# Altium project PROC114E3_SCH.PrjPcb (part 18 of 22)

## Sheet 36.SchDoc
size 513 x 386 mm
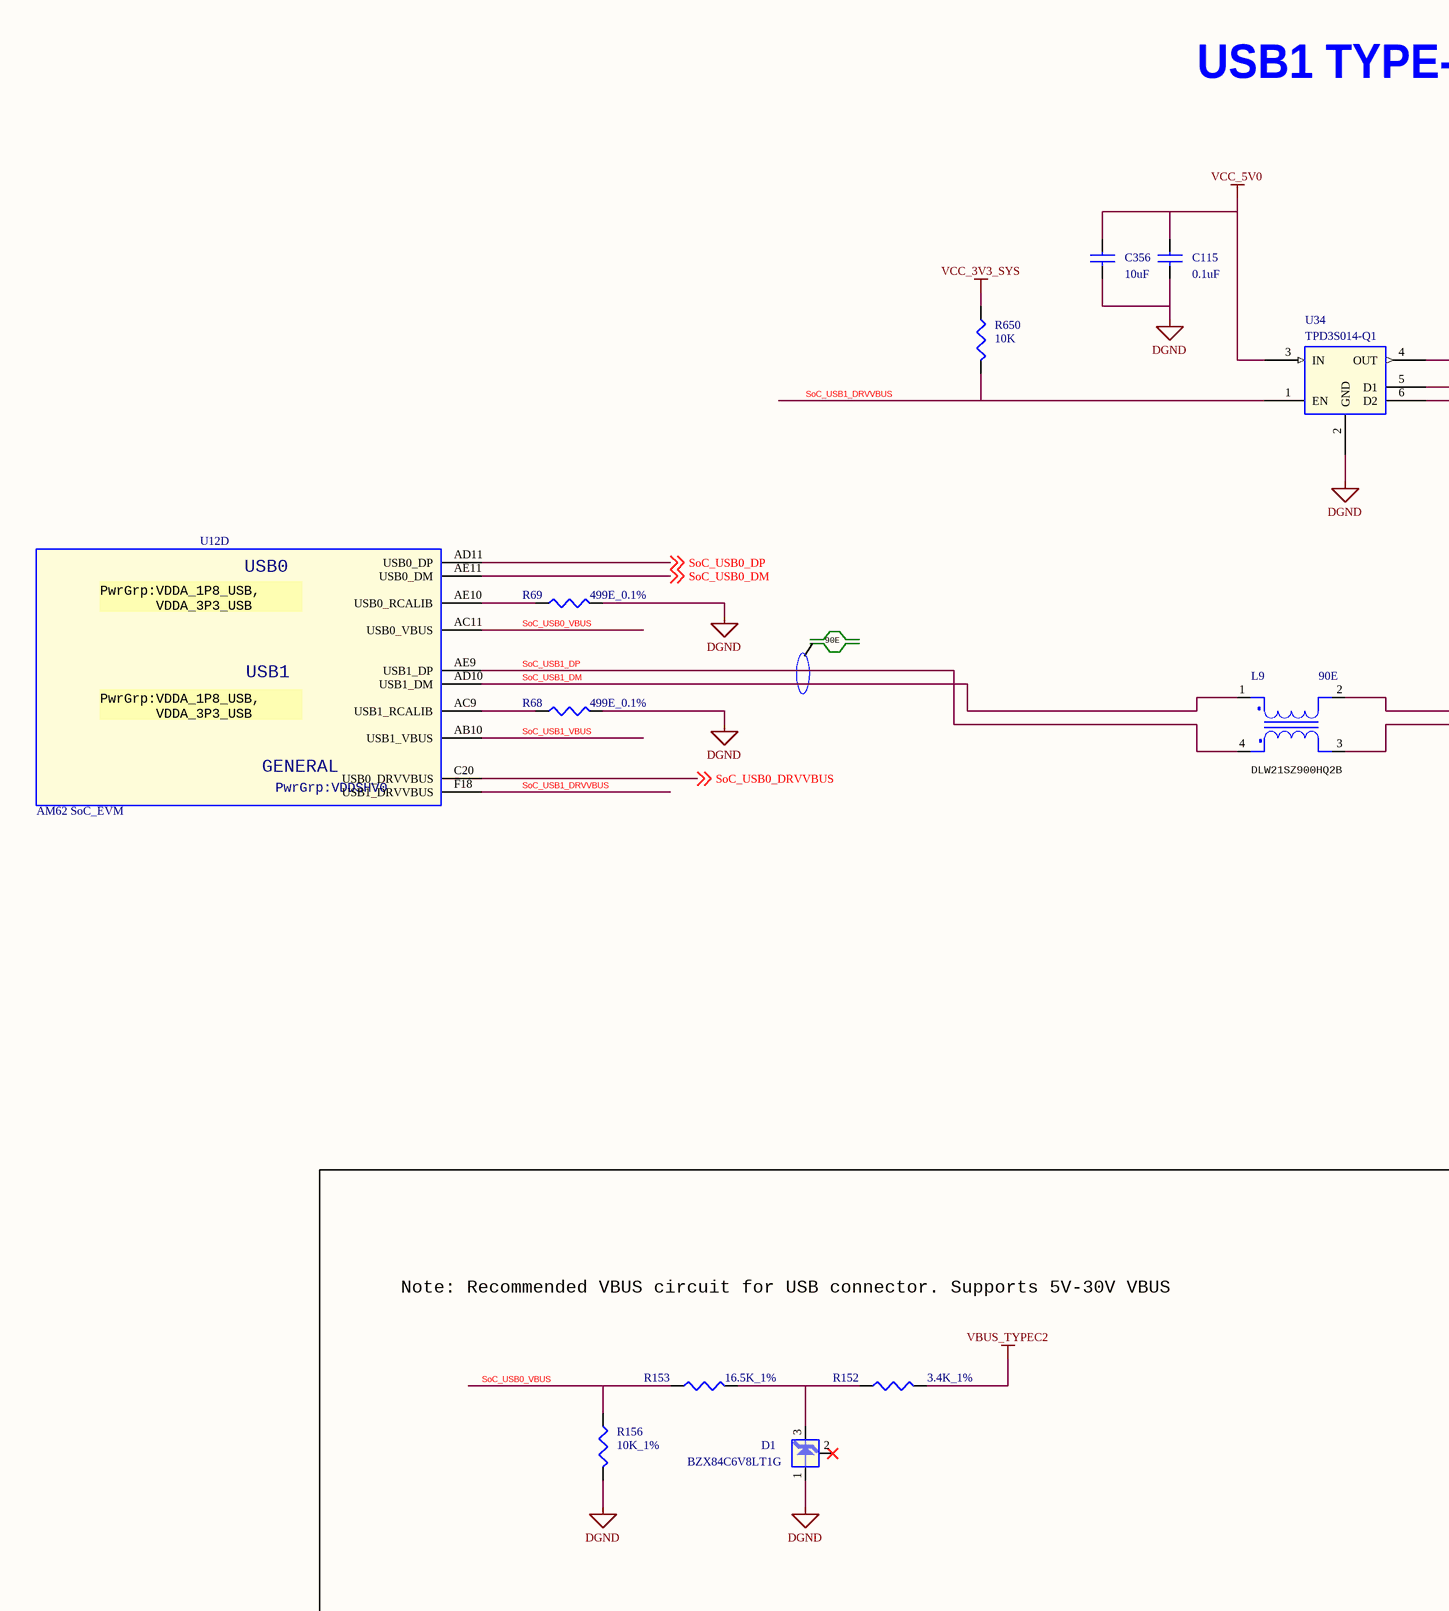
[diagram p64: 36.SchDoc, left]
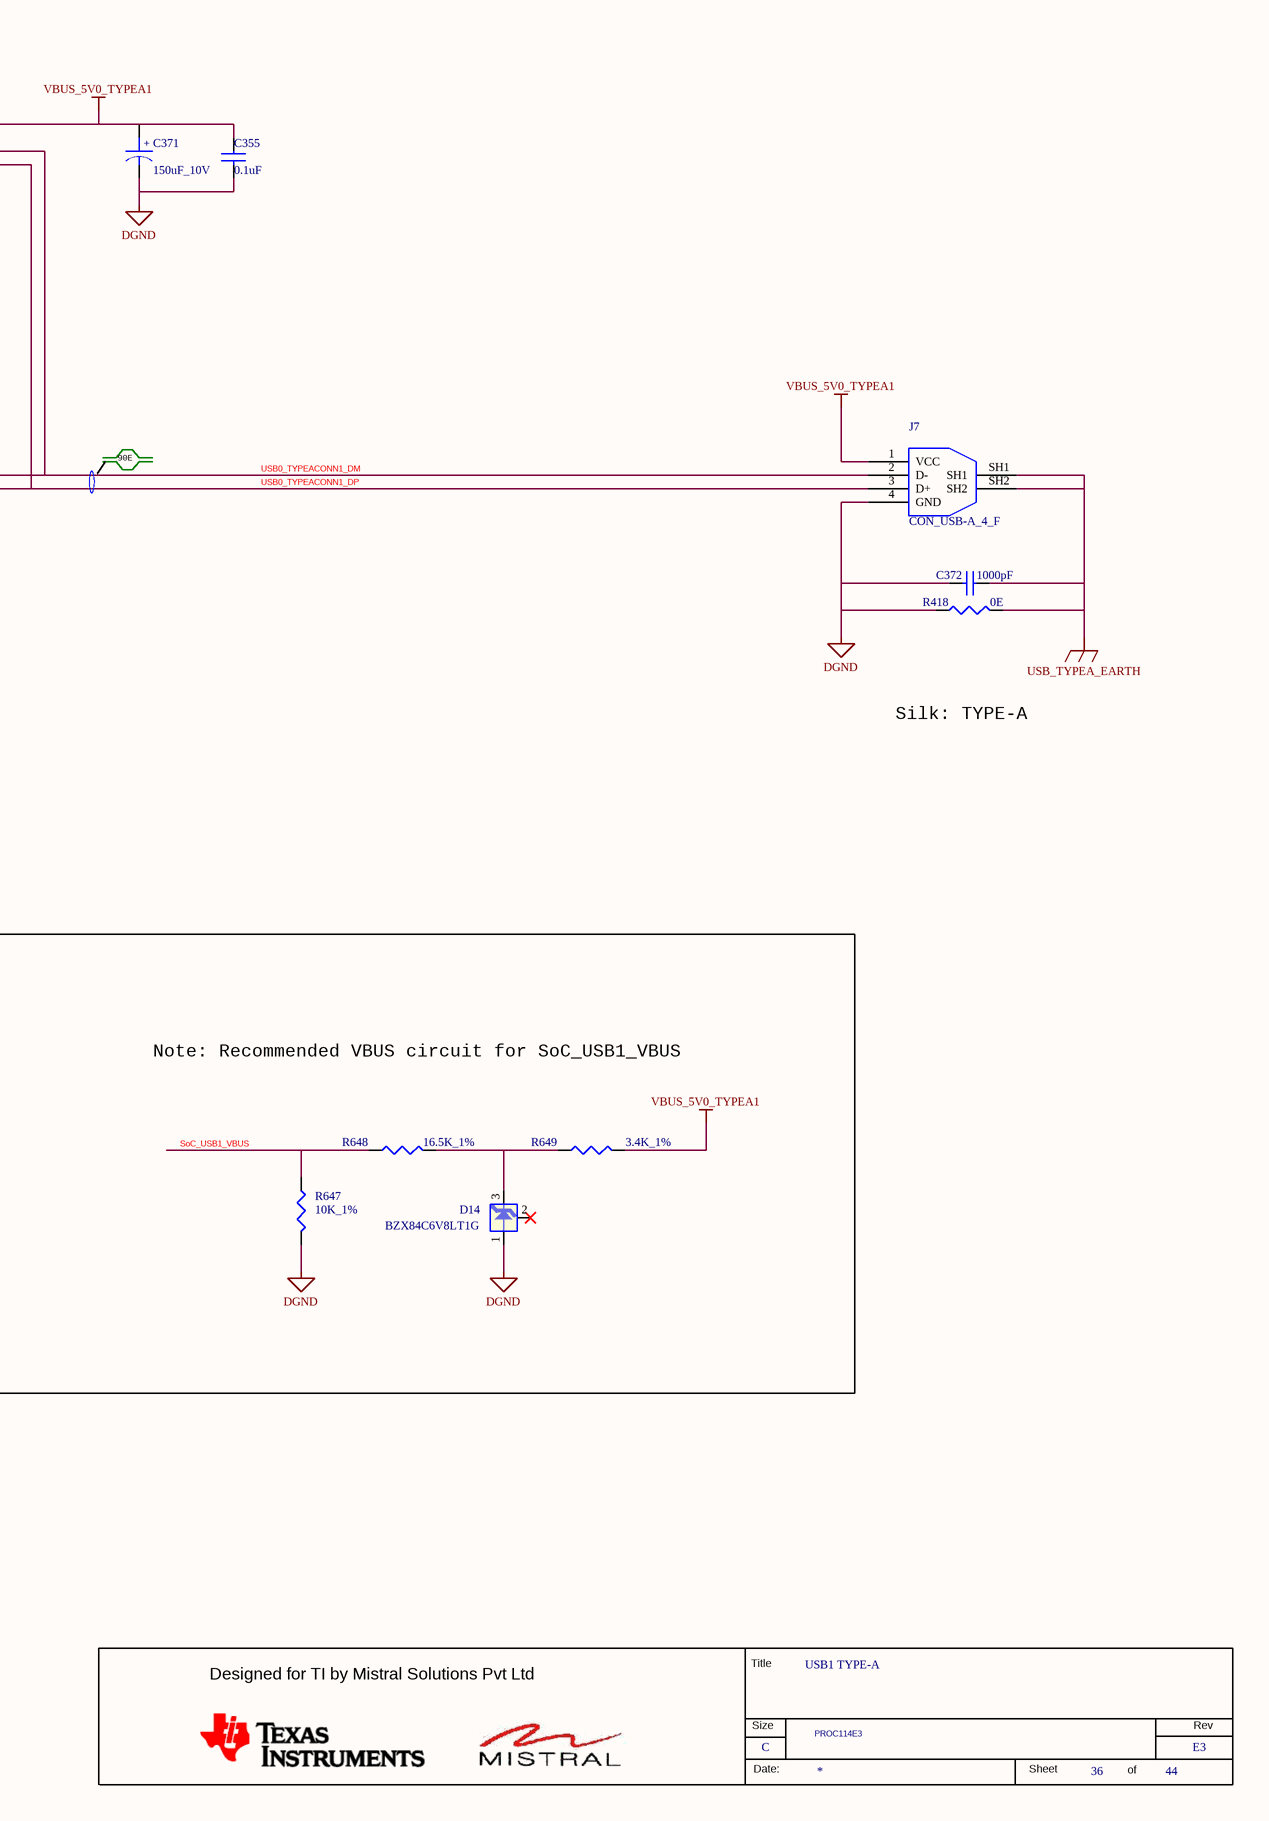
[diagram p65: 36.SchDoc, right]

### Parts
(Parts that share a designator on the sheet are numbered #1, #2 ... from top to bottom, then left to right.)
*#36  RevCode: E3  Title: USB1 TYPE-A  Page Size: C  Page Number: 36  Page Count: 44  Variant Name: PROC114E3  (hidden comment: MISTRAL_TITLEBLK_CSIZE)  (graphical)
C115  0.1uF  [CAP0201_0-5]
C355  0.1uF  [CAP0201_0-5]
C356  10uF  [CAP0603_1]
C371  150uF_10V  [CAPT7343D_3-25]
C372  1000pF  [CAP1206_1-75]
D1  BZX84C6V8LT1G  [SOT23-123_1-2]
D14  BZX84C6V8LT1G  [SOT23-123_1-2]
J7  CON_USB-A_4_F  [CON_USBA4_629104151_S_R_S_7-4]
L9  90E  [IND4_DLW21H_90X60_SMD_1-4]
R68  499E_0.1%  [RES0402_0-5]
R69  499E_0.1%  [RES0402_0-5]
R152  3.4K_1%  [RES0201_0-5]
R153  16.5K_1%  [RES0402_0-5]
R156  10K_1%  [RES0201_0-5]
R418  0E  [RES0603_0-75]
R647  10K_1%  [RES0201_0-5]
R648  16.5K_1%  [RES0402_0-5]
R649  3.4K_1%  [RES0201_0-5]
R650  10K  [RES0201_0-5]
U12#2  AM62 SoC_EVM  [BGA425_19-68_510X510_0-7]  (part D of 18)
U34  TPD3S014-Q1  [SOT23-6_1-5]

### Blocks framed on the sheet
Note: Recommended VBUS circuit for SoC_USB1_VBUS: D1 D14 R152 R153 R156 R647-R649

### Nets
DGND: C115.2 C355.2 C356.2 C371.2 C372.2 D1.1(A) D14.1(A) J7.4(GND) R68.2 R69.2 R156.2 R418.2 R647.2 U34.2(GND)
USB_TYPEA_EARTH: C372.1 J7.SH1 J7.SH2 R418.1
VBUS_5V0_TYPEA1: C355.1 C371.1 J7.1(VCC) R649.2 U34.4(OUT)
VBUS_TYPEC2: R152.2
VCC_3V3_SYS: R650.1
VCC_5V0: C115.1 C356.1 U34.3(IN)
SoC_USB0_DM: U12#2.AE11(USB0_DM) ; off-sheet SoC_USB0_DM
SoC_USB0_DP: U12#2.AD11(USB0_DP) ; off-sheet SoC_USB0_DP
SoC_USB0_DRVVBUS: U12#2.C20(USB0_DRVVBUS) ; off-sheet SoC_USB0_DRVVBUS
SoC_USB0_VBUS: R153.1 R156.1 U12#2.AC11(USB0_VBUS)
SoC_USB1_DM: L9.1(IN1) U12#2.AD10(USB1_DM)
SoC_USB1_DP: L9.4(OUT2) U12#2.AE9(USB1_DP)
SoC_USB1_DRVVBUS: R650.2 U12#2.F18(USB1_DRVVBUS) U34.1(EN)
SoC_USB1_VBUS: R647.1 R648.1 U12#2.AB10(USB1_VBUS)
USB0_TYPEACONN1_DM: J7.2(D-) L9.2(IN2) U34.5(D1)
USB0_TYPEACONN1_DP: J7.3(D+) L9.3(OUT1) U34.6(D2)
NetD1_3: D1.3(C) R152.1 R153.2
NetD14_3: D14.3(C) R648.2 R649.1
NetR68_1: R68.1 U12#2.AC9(USB1_RCALIB)
NetR69_1: R69.1 U12#2.AE10(USB0_RCALIB)

Not connected (* = marked no-connect by the designer): D1 2(NC)*; D14 2(NC)*

### Notes on the sheet
- USB1 TYPE-A
- 90E
- (near L9) DLW21SZ900HQ2B
- Silk: TYPE-A
- Note: Recommended VBUS circuit for USB connector. Supports 5V-30V VBUS
- (in symbol AM62-EVM_BGA425, part D) USB0; PwrGrp:VDDA_1P8_USB, / VDDA_3P3_USB; USB1; GENERAL; PwrGrp:VDDSHV0
- (in symbol CAP_POL) +
- (in symbol MISTRAL_TITLEBLK_CSIZE) Title; Designed for TI by Mistral Solutions Pvt Ltd; Size; Rev; Date:; Sheet; of

### Library data of the parts
*#36 = MISTRAL_TITLEBLK_CSIZE: Issue: 1.0; Page Create Date: March  8, 1995; Page Modify Date: *; Schematic Page Count: 44; Schematic Page Number: 36
C115 = CAP_Dup2: CAP CERAMIC 0.1uF 16V 10% X5R 0201; Part_type: CAPACITORS\CERAMIC; Mfr_part_number: GRM033R61C104KE14D; Mfr_name: MURATA; Mistral Part No: 120009030072-R; Custom_Duty: 15%; Customs_HS_Code: 85322990; Wattage: NA; Project: TI_MAXIE_CPB; Footprint Path: Y:\MIS_DATABASE\Library\ALTIUM_TOOL\PCB_FOOTPRINTS\Altium_Footprint_Lib.PcbLib; Library Path: Y:\MIS_DATABASE\Library\ALTIUM_TOOL\SCHEMATICS_PARTS\MS_DISCRETE_Library.schlib; MECHANICAL 3D STEP FILE: CAP0201_0-5; Chkd/date: MANIRAJA/230118; Crtd /date: MANIRAJA/230118; Datasheet: Y:\MIS_DATABASE\DATASHEETS\CAPACITORS\GRM033R61C104KE14.PDF; Temperature: -55°C+85°C; Weight: 0.33mg; Height: 0.33MM; Footprint Ref: CAP0201_0-5; Library Ref: CAP; Distributor_part_number: 490-14305-1-ND; Distributor_name: DIGIKEY; Package: 0201; Voltage: 16V; Tolerance: 10%; PCB Footprint: CAP0201_0-5
C355 = CAP_Dup2: CAP CERAMIC 0.1uF 16V 10% X5R 0201; Mistral Part No: 120009030072-R; Mfr_name: MURATA; Mfr_part_number: GRM033R61C104KE14D; Part_type: CAPACITORS\CERAMIC; Project: TI_MAXIE_CPB; Wattage: NA; Customs_HS_Code: 85322990; Custom_Duty: 15%; Tolerance: 10%; Voltage: 16V; Package: 0201; Distributor_name: DIGIKEY; Distributor_part_number: 490-14305-1-ND; Library Ref: CAP; Footprint Ref: CAP0201_0-5; Height: 0.33MM; Weight: 0.33mg; Temperature: -55°C+85°C; Datasheet: Y:\MIS_DATABASE\DATASHEETS\CAPACITORS\GRM033R61C104KE14.PDF; Crtd /date: MANIRAJA/230118; Chkd/date: MANIRAJA/230118; MECHANICAL 3D STEP FILE: CAP0201_0-5; Library Path: Y:\MIS_DATABASE\Library\ALTIUM_TOOL\SCHEMATICS_PARTS\MS_DISCRETE_Library.schlib; Footprint Path: Y:\MIS_DATABASE\Library\ALTIUM_TOOL\PCB_FOOTPRINTS\Altium_Footprint_Lib.PcbLib; PCB Footprint: CAP0201_0-5
C356 = CAP_Dup2: CAP CERAMIC 10uF 35V 20% X5R 0603; Part_type: CAPACITORS\CERAMIC; Mfr_part_number: GRM188R6YA106MA73D; Mfr_name: MURATA; Mistral Part No: 120019050016-R; Custom_Duty: 15%; Customs_HS_Code: 85322990; Wattage: NA; Project: BRUKER_SD820_COMMONDO; Footprint Path: Y:\MIS_DATABASE\Library\ALTIUM_TOOL\PCB_FOOTPRINTS\Altium_Footprint_Lib.PcbLib; Library Path: Y:\MIS_DATABASE\Library\ALTIUM_TOOL\SCHEMATICS_PARTS\MS_DISCRETE_Library.schlib; MECHANICAL 3D STEP FILE: CAP0603_1; Chkd/date: MANIRAJA/170519; Crtd /date: ALVY/160519; Datasheet: Y:\MIS_DATABASE\DATASHEETS\CAPACITORS\GRM188R6YA106MA73.PDF; Temperature: -55°C+85°C; Weight: 9mg; Height: 1.00MM; Footprint Ref: CAP0603_1; Library Ref: CAP; Distributor_part_number: 490-13248-1-ND; Distributor_name: DIGIKEY; Package: 0603; Voltage: 35V; Tolerance: 20%; PCB Footprint: CAP0603_1
C371 = CAP_POL: CAP TANTALUM 150uF 10V 10% ESR 600mE D7343; Part_type: CAPACITORS\TANTALUM; Mfr_part_number: 293D157X9010D2TE3; Mfr_name: VISHAY; Mistral Part No: 120021090007-R; Custom_Duty: 15%; Customs_HS_Code: 85322990; Wattage: NA; Project: TI_AM62x SKEVM_BRD; Footprint Path: Y:\MIS_DATABASE\Library\ALTIUM_TOOL\PCB_FOOTPRINTS\Altium_Footprint_Lib.PcbLib; Library Path: Y:\MIS_DATABASE\Library\ALTIUM_TOOL\SCHEMATICS_PARTS\MS_DISCRETE_Library.schlib; MECHANICAL 3D STEP FILE: CAPT7343D_3-25; Chkd/date: ALVY/200921; Crtd /date: MANIRAJA/200921; Datasheet: Y:\MIS_DATABASE\DATASHEETS\CAPACITORS\293D_SER_MAR20.PDF; Temperature: -55°C+125°C; Weight: 400mg; Height: 3.10MM; Footprint Ref: CAPT7343D_3-25; Library Ref: CAP_POL; Distributor_part_number: 718-1960-1-ND; Distributor_name: DIGIKEY; Package: D7343; Voltage: 10V; Tolerance: 10%; PCB Footprint: CAPT7343D_3-25
C372 = CAP_Dup2: CAP CERAMIC 1000pF 2KV 10% X7R 1206; Part_type: CAPACITORS\CERAMIC; Mfr_part_number: 1206GC102KAT1A; Mfr_name: AVX CORPORATION; Mistral Part No: 120015080006-R; Wattage: NA; Custom_Duty: 15%; Customs_HS_Code: 85322990; Project: ADR1B; MECHANICAL 3D STEP FILE: CAP1206_1-75; Footprint Path: Y:\MIS_DATABASE\Library\ALTIUM_TOOL\PCB_FOOTPRINTS\Altium_Footprint_Lib.PcbLib; Library Path: Y:\MIS_DATABASE\Library\ALTIUM_TOOL\SCHEMATICS_PARTS\MS_DISCRETE_Library.schlib; Footprint Ref: CAP1206_1-75; Library Ref: CAP; Chkd/date: SHREESHAIL/291106; Crtd /date: MAZHAR/281106; Datasheet: Y:\MIS_DATABASE\DATASHEETS\CAPACITORS\AVX_HV-MLC.PDF; Temperature: -55°C+125°C; Weight: 16.2mg; Height: 1.52MM; Distributor_part_number: 478-2956-1-ND; Distributor_name: DIGIKEY; Package: 1206; Voltage: 2KV; Tolerance: 10%; PCB Footprint: CAP1206_1-75
D1 = DIODE_ZENER_SOT23_13: DIODE ZENER 250mW 6.8V SOT23-123; Mistral Part No: 130017100002-R; Mfr_name: ON SEMICONDUCTOR; Part_type: DIODE\ZENER; Project: TI_MAXIE_CPB; Tolerance: NA; Customs_HS_Code: 85412900; Custom_Duty: 15%; Mfr_part_number: BZX84C6V8LT1G; Voltage: 6.8V; Wattage: NA; Package: SOT23-123; Distributor_name: DIGIKEY; Distributor_part_number: BZX84C6V8LT1GOSCT-ND; Library Ref: DIODE_ZENER_SOT23_13; Height: 1.11MM; Weight: 8mg; Temperature: -65°C+150°C; Datasheet: Y:\MIS_DATABASE\DATASHEETS\DISCRETES\DIODES\BZX84XX.PDF; Crtd /date: MANIRAJA/031017; Chkd/date: MANIRAJA/031017; MECHANICAL 3D STEP FILE: SOT23-123_1-2; PCB Footprint: SOT23-123_1-2
D14 = DIODE_ZENER_SOT23_13: DIODE ZENER 250mW 6.8V SOT23-123; Part_type: DIODE\ZENER; Mfr_name: ON SEMICONDUCTOR; Mistral Part No: 130017100002-R; Custom_Duty: 15%; Customs_HS_Code: 85412900; Wattage: NA; Project: TI_MAXIE_CPB; MECHANICAL 3D STEP FILE: SOT23-123_1-2; Chkd/date: MANIRAJA/031017; Crtd /date: MANIRAJA/031017; Datasheet: Y:\MIS_DATABASE\DATASHEETS\DISCRETES\DIODES\BZX84XX.PDF; Temperature: -65°C+150°C; Weight: 8mg; Height: 1.11MM; Library Ref: DIODE_ZENER_SOT23_13; Distributor_part_number: BZX84C6V8LT1GOSCT-ND; Distributor_name: DIGIKEY; Package: SOT23-123; Voltage: 6.8V; Tolerance: NA; Mfr_part_number: BZX84C6V8LT1G; PCB Footprint: SOT23-123_1-2
J7 = CON_USB-A_4_2SH: CON USB-A TYPE 4POS FEMALE RT SMD; Part_type: CONNECTOR\USB; Mfr_part_number: 629104151021; Mfr_name: WURTH ELECTRONICS; Mistral Part No: 150017100042-R; Custom_Duty: 24%; Customs_HS_Code: 85369090; Wattage: NA; Project: TI_SVB_MAXWELL_SPM; MECHANICAL 3D STEP FILE: CON_USBA4_629104151_S_R_S_7-4; Chkd/date: MANIRAJA/271017; Crtd /date: MANIRAJA/271017; Datasheet: Y:\MIS_DATABASE\DATASHEETS\CONNECTORS\629104151021.PDF; Temperature: -40°C+85°C; Weight: NA; Height: 7.35MM; Library Ref: CON_USB-A_4_2SH; Distributor_part_number: 732-5969-1-ND; Distributor_name: DIGIKEY; Package: SMD; Voltage: NA; Tolerance: NA; PCB Footprint: CON_USBA4_629104151_S_R_S_7-4
L9 = INDUCTOR_DLW31S: as L10 on sheet 35; PCB Footprint: IND4_DLW21H_90X60_SMD_1-4; Footprint Path: Y:\MIS_DATABASE\Library\ALTIUM_TOOL\PCB_FOOTPRINTS\Altium_Footprint_Lib.PcbLib; Library Path: Y:\MIS_DATABASE\Library\ALTIUM_TOOL\SCHEMATICS_PARTS\MS_DISCRETE_Library.schlib; MECHANICAL 3D STEP FILE: IND4_DLW21H_90X60_SMD_1-4; Chkd/date: MANIRAJA/270619; Crtd /date: MANIRAJA/270619; Datasheet: Y:\MIS_DATABASE\DATASHEETS\DISCRETES\INDUCTORS\DLW21SZ900HQ2B.PDF; Temperature: -40°C+105°C; Weight: 11mg; Height: 1.40MM; Footprint Ref: IND4_DLW21H_90X60_SMD_1-4; Library Ref: INDUCTOR_DLW31S; Distributor_part_number: NA; Distributor_name: NA; Package: SMD; Voltage: NA; Tolerance: NA; Part_type: INDUCTOR
R68 R69 = RESISTOR_Dup6: RES 499E 1/16W 0.1% 0402; Mistral Part No: 110021020006-R; Mfr_name: YAGEO AMERICA; Mfr_part_number: RT0402BRD07499RL; Part_type: RESISTORS\FIXED; Project: TI_AM62x SKEVM_BRD; Voltage: NA; Customs_HS_Code: 85332119; Custom_Duty: 15%; Tolerance: 0.1%; Wattage: 1/16W; Package: 0402; Distributor_name: DIGIKEY; Distributor_part_number: YAG1440CT-ND; Library Ref: RESISTOR; Footprint Ref: RES0402_0-5; Height: 0.35MM; Weight: 0.65mg; Temperature: -55°C+155°C; Datasheet: Y:\MIS_DATABASE\DATASHEETS\RESISTORS\YAGEO_RT-SERIES.PDF; Crtd /date: MANIRAJA/200921; Chkd/date: ALVY/200921; MECHANICAL 3D STEP FILE: RES0402_0-5; Library Path: Y:\MIS_DATABASE\Library\ALTIUM_TOOL\SCHEMATICS_PARTS\MS_DISCRETE_Library.schlib; Footprint Path: Y:\MIS_DATABASE\Library\ALTIUM_TOOL\PCB_FOOTPRINTS\Altium_Footprint_Lib.PcbLib; PCB Footprint: RES0402_0-5
R152 = RESISTOR_Dup6: RES 3.4K 1/20W 1% 0201; Part_type: RESISTORS\FIXED; Mfr_part_number: ERJ-1GNF3401C; Mfr_name: PANASONIC-ECG; Mistral Part No: 110016010003-R; Custom_Duty: 15%; Customs_HS_Code: 85332119; Voltage: NA; Project: QUADIO; Footprint Path: Y:\MIS_DATABASE\Library\ALTIUM_TOOL\PCB_FOOTPRINTS\Altium_Footprint_Lib.PcbLib; Library Path: Y:\MIS_DATABASE\Library\ALTIUM_TOOL\SCHEMATICS_PARTS\MS_DISCRETE_Library.schlib; MECHANICAL 3D STEP FILE: RES0201_0-5; Chkd/date: VASANTHA/250116; Crtd /date: VASANTHA/250116; Datasheet: Y:\MIS_DATABASE\DATASHEETS\RESISTORS\PAN-ERJSER_NOV17.PDF; Temperature: -55°C+125°C; Weight: 0.15mg; Height: 0.26MM; Library Ref: RESISTOR; Distributor_part_number: ERJ-1GNF3401C-ND; Distributor_name: DIGIKEY; Package: 0201; Wattage: 1/20W; Tolerance: 1%; Footprint Ref: RES0201_0-5; PCB Footprint: RES0201_0-5
R153 = RESISTOR_Dup6: RES 16.5K 1/16W 1% 0402; Part_type: RESISTORS\FIXED; Mfr_part_number: RC0402FR-0716K5L; Mfr_name: YAGEO AMERICA; Mistral Part No: 110020120011-R; Custom_Duty: 15%; Customs_HS_Code: 85332119; Voltage: NA; Project: TI_AM243x LP EVM; Footprint Path: Y:\MIS_DATABASE\Library\ALTIUM_TOOL\PCB_FOOTPRINTS\Altium_Footprint_Lib.PcbLib; Library Path: Y:\MIS_DATABASE\Library\ALTIUM_TOOL\SCHEMATICS_PARTS\MS_DISCRETE_Library.schlib; MECHANICAL 3D STEP FILE: RES0402_0-5; Chkd/date: ALVY/091220; Crtd /date: MANIRAJA/091220; Datasheet: Y:\MIS_DATABASE\DATASHEETS\RESISTORS\RCXXXXL-SER_MAR18.PDF; Temperature: -55°C+155°C; Weight: 0.65mg; Height: 0.40MM; Library Ref: RESISTOR; Distributor_part_number: YAG3002CT-ND; Distributor_name: DIGIKEY; Package: 0402; Wattage: 1/16W; Tolerance: 1%; Footprint Ref: RES0402_0-5; PCB Footprint: RES0402_0-5
R156 = RESISTOR_Dup6: RES 10K 1/20W 1% 0201; Part_type: RESISTORS\FIXED; Mfr_part_number: RC0201FR-0710KL; Mfr_name: YAGEO AMERICA; Mistral Part No: 110011040018-R; Custom_Duty: 15%; Customs_HS_Code: 85332119; Voltage: NA; Project: GOLDEN-I LITE; Footprint Path: Y:\MIS_DATABASE\Library\ALTIUM_TOOL\PCB_FOOTPRINTS\Altium_Footprint_Lib.PcbLib; Library Path: Y:\MIS_DATABASE\Library\ALTIUM_TOOL\SCHEMATICS_PARTS\MS_DISCRETE_Library.schlib; MECHANICAL 3D STEP FILE: RES0201_0-5; Chkd/date: VASANTHA/270117; Crtd /date: MANIRAJA/270117; Datasheet: Y:\MIS_DATABASE\DATASHEETS\RESISTORS\RCXXXXL-SER_MAR18.PDF; Temperature: -55°C+125°C; Weight: 0.17mg; Height: 0.26MM; Library Ref: RESISTOR; Distributor_part_number: 311-10.0KMCT-ND; Distributor_name: DIGIKEY; Package: 0201; Wattage: 1/20W; Tolerance: 1%; Footprint Ref: RES0201_0-5; PCB Footprint: RES0201_0-5
R418 = RESISTOR_Dup6: RES 0E 1/10W 5% 0603; Mistral Part No: 110011020013-R; Mfr_name: PANASONIC-ECG; Mfr_part_number: RC0603JR-070RL; Part_type: RESISTORS\FIXED; Manufacturer: YAGEO AMERICA; Project: KENNEL; Voltage: NA; Customs_HS_Code: 85332119; Custom_Duty: 15%; Footprint Path: Y:\MIS_DATABASE\Library\ALTIUM_TOOL\PCB_FOOTPRINTS\Altium_Footprint_Lib.PcbLib; Library Path: Y:\MIS_DATABASE\Library\ALTIUM_TOOL\SCHEMATICS_PARTS\MS_DISCRETE_Library.schlib; Footprint Ref: RES0603_0-75; Library Ref: RESISTOR; Tolerance: 5%; Wattage: 1/10W; Package: 0603; Distributor_name: DIGIKEY; Distributor_part_number: 311-0.0GRCT-ND; Height: 0.55MM; Weight: 2mg; Temperature: -55°C+155°C; Datasheet: Y:\MIS_DATABASE\DATASHEETS\RESISTORS\RCXXXXL-SER_MAR18.PDF; Crtd /date: BAVISH/180211; Chkd/date: MANIRAJA/051217; MECHANICAL 3D STEP FILE: RES0603_0-75; PCB Footprint: RES0603_0-75
R647 = RESISTOR_Dup6: RES 10K 1/20W 1% 0201; Mistral Part No: 110011040018-R; Mfr_name: YAGEO AMERICA; Mfr_part_number: RC0201FR-0710KL; Part_type: RESISTORS\FIXED; Project: GOLDEN-I LITE; Voltage: NA; Customs_HS_Code: 85332119; Custom_Duty: 15%; Footprint Ref: RES0201_0-5; Tolerance: 1%; Wattage: 1/20W; Package: 0201; Distributor_name: DIGIKEY; Distributor_part_number: 311-10.0KMCT-ND; Library Ref: RESISTOR; Height: 0.26MM; Weight: 0.17mg; Temperature: -55°C+125°C; Datasheet: Y:\MIS_DATABASE\DATASHEETS\RESISTORS\RCXXXXL-SER_MAR18.PDF; Crtd /date: MANIRAJA/270117; Chkd/date: VASANTHA/270117; MECHANICAL 3D STEP FILE: RES0201_0-5; Library Path: Y:\MIS_DATABASE\Library\ALTIUM_TOOL\SCHEMATICS_PARTS\MS_DISCRETE_Library.schlib; Footprint Path: Y:\MIS_DATABASE\Library\ALTIUM_TOOL\PCB_FOOTPRINTS\Altium_Footprint_Lib.PcbLib; PCB Footprint: RES0201_0-5
R648 = RESISTOR_Dup6: RES 16.5K 1/16W 1% 0402; Mistral Part No: 110020120011-R; Mfr_name: YAGEO AMERICA; Mfr_part_number: RC0402FR-0716K5L; Part_type: RESISTORS\FIXED; Project: TI_AM243x LP EVM; Voltage: NA; Customs_HS_Code: 85332119; Custom_Duty: 15%; Footprint Ref: RES0402_0-5; Tolerance: 1%; Wattage: 1/16W; Package: 0402; Distributor_name: DIGIKEY; Distributor_part_number: YAG3002CT-ND; Library Ref: RESISTOR; Height: 0.40MM; Weight: 0.65mg; Temperature: -55°C+155°C; Datasheet: Y:\MIS_DATABASE\DATASHEETS\RESISTORS\RCXXXXL-SER_MAR18.PDF; Crtd /date: MANIRAJA/091220; Chkd/date: ALVY/091220; MECHANICAL 3D STEP FILE: RES0402_0-5; Library Path: Y:\MIS_DATABASE\Library\ALTIUM_TOOL\SCHEMATICS_PARTS\MS_DISCRETE_Library.schlib; Footprint Path: Y:\MIS_DATABASE\Library\ALTIUM_TOOL\PCB_FOOTPRINTS\Altium_Footprint_Lib.PcbLib; PCB Footprint: RES0402_0-5
R649 = RESISTOR_Dup6: RES 3.4K 1/20W 1% 0201; Mistral Part No: 110016010003-R; Mfr_name: PANASONIC-ECG; Mfr_part_number: ERJ-1GNF3401C; Part_type: RESISTORS\FIXED; Project: QUADIO; Voltage: NA; Customs_HS_Code: 85332119; Custom_Duty: 15%; Footprint Ref: RES0201_0-5; Tolerance: 1%; Wattage: 1/20W; Package: 0201; Distributor_name: DIGIKEY; Distributor_part_number: ERJ-1GNF3401C-ND; Library Ref: RESISTOR; Height: 0.26MM; Weight: 0.15mg; Temperature: -55°C+125°C; Datasheet: Y:\MIS_DATABASE\DATASHEETS\RESISTORS\PAN-ERJSER_NOV17.PDF; Crtd /date: VASANTHA/250116; Chkd/date: VASANTHA/250116; MECHANICAL 3D STEP FILE: RES0201_0-5; Library Path: Y:\MIS_DATABASE\Library\ALTIUM_TOOL\SCHEMATICS_PARTS\MS_DISCRETE_Library.schlib; Footprint Path: Y:\MIS_DATABASE\Library\ALTIUM_TOOL\PCB_FOOTPRINTS\Altium_Footprint_Lib.PcbLib; PCB Footprint: RES0201_0-5
R650 = RESISTOR_Dup6: as R541 on sheet 31; Tolerance: 5%; Wattage: 1/20W; Package: 0201; Distributor_name: DIGIKEY; Distributor_part_number: 311-10KNCT-ND; Library Ref: RESISTOR; Footprint Ref: RES0201_0-5; Height: 0.26MM; Weight: 0.17mg; Temperature: -55°C+125°C; Datasheet: Y:\MIS_DATABASE\DATASHEETS\RESISTORS\RCXXXXL-SER_MAR18.PDF; Crtd /date: MANIRAJA/050517; Chkd/date: MANIRAJA/050517; MECHANICAL 3D STEP FILE: RES0201_0-5; Library Path: Y:\MIS_DATABASE\Library\ALTIUM_TOOL\SCHEMATICS_PARTS\MS_DISCRETE_Library.schlib; Footprint Path: Y:\MIS_DATABASE\Library\ALTIUM_TOOL\PCB_FOOTPRINTS\Altium_Footprint_Lib.PcbLib; PCB Footprint: RES0201_0-5
U12#2 = AM62-EVM_BGA425: IC AM62 SoC MICROPROCESSOR BGA425; Part_type: ICS\DIGITAL\MICROPROCESSOR; Mfr_name: TEXAS INSTRUMENTS; Mistral Part No: 141221060001; Custom_Duty: 15%; Customs_HS_Code: 85423100; Wattage: NA; Project: AM62_EVM_BRD; Footprint Path: Y:\MIS_DATABASE\Library\ALTIUM_TOOL\PCB_FOOTPRINTS\Altium_Footprint_Lib.PcbLib; Library Path: Y:\MIS_DATABASE\Library\ALTIUM_TOOL\SCHEMATICS_PARTS\MS_MICROPROCESSOR_Library.schlib; MECHANICAL 3D STEP FILE: BGA425_19-68_510X510_0-7; RoHS: NA; Chkd/date: ALVY/110621; Crtd /date: MANIRAJA/110621; Datasheet: Y:\MIS_DATABASE\DATASHEETS\ICS\DIGITAL\MICROCONTROLLER\AM62-SoC_SVB.PDF; Temperature: NA; Weight: NA; Height: 0.65MM; Footprint Ref: BGA425_19-68_510X510_0-7; Library Ref: AM62-EVM_BGA425; Distributor_part_number: NA; Distributor_name: NA; Package: BGA425; Voltage: NA; Tolerance: NA; Mfr_part_number: AM62 SoC_EVM; PCB Footprint: BGA425_19-68_510X510_0-7
U34 = TPD3S014D_SOT23-6: IC ESD PROTECTION FOR AUTO USB PORT WITH CURRENT LIMIT SWITCH SOT23-6; Mistral Part No: 141018090014-R; Mfr_name: TEXAS INSTRUMENTS; Mfr_part_number: TPD3S014TDBVRQ1; Part_type: ICS\INTERFACE; Project: TI_J7ES_EVM_CP; Tolerance: NA; Customs_HS_Code: 85423100; Custom_Duty: 15%; PCB Footprint: SOT23-6_1-5; Footprint Ref: SOT23-6_1-5; Voltage: NA; Wattage: NA; Package: SOT23-6; Distributor_name: DIGIKEY; Distributor_part_number: 296-44163-1-ND; Library Ref: TPD3S014D_SOT23-6; Height: 1.45MM; Weight: NA; Temperature: -40°C+105°C; Datasheet: Y:\MIS_DATABASE\DATASHEETS\ICS\INTERFACE\TPD3S014-Q1.PDF; Crtd /date: ALVY/180918; Chkd/date: MANIRAJA/180918; MECHANICAL 3D STEP FILE: SOT23-6_1-5; Library Path: Y:\MIS_DATABASE\Library\ALTIUM_TOOL\SCHEMATICS_PARTS\MS_MISCINTERFACE_Library.schlib; Footprint Path: Y:\MIS_DATABASE\Library\ALTIUM_TOOL\PCB_FOOTPRINTS\Altium_Footprint_Lib.PcbLib